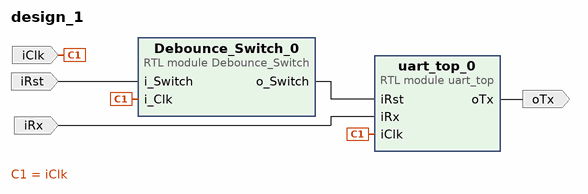
[diagram p0: block diagram of the top level]
# Vivado block design design_1, xc7z020clg400-1, Vivado 2020.1
create_bd_design design_1

create_bd_port -dir I -type clk iClk
create_bd_port -dir I iRst
create_bd_port -dir I iRx
create_bd_port -dir O oTx

create_bd_cell -type module -reference Debounce_Switch Debounce_Switch_0
create_bd_cell -type module -reference uart_top uart_top_0

# ---- connections ----

connect_bd_net [get_bd_pins Debounce_Switch_0/o_Switch] [get_bd_pins uart_top_0/iRst]
connect_bd_net -net i_Clk_0_1 [get_bd_ports iClk] [get_bd_pins Debounce_Switch_0/i_Clk] [get_bd_pins uart_top_0/iClk]
connect_bd_net -net i_Switch_0_1 [get_bd_ports iRst] [get_bd_pins Debounce_Switch_0/i_Switch]
connect_bd_net -net iRx_0_1 [get_bd_ports iRx] [get_bd_pins uart_top_0/iRx]
connect_bd_net [get_bd_pins uart_top_0/oTx] [get_bd_ports oTx]

validate_bd_design
save_bd_design
